# Altium schematic sheet РЕУН.468323.001_Laser_Interface.SchDoc: =Name-1str
size 840 x 594 mm; SheetNumber: 12; Вид изделия: Документация; Раздел: Документация; Код документа: Э3; Вид документа: Схема электрическая принципиальная; Класс документа: Конструкторский документ; Создавать изделие в PLM: Yes; DocumentCode: РЕУН.468323.001 Э3 2D; DocumentView: Схема электрическая принципиальная; DocumentClass: Конструкторский документ; ProductView: Документация; Format: А1
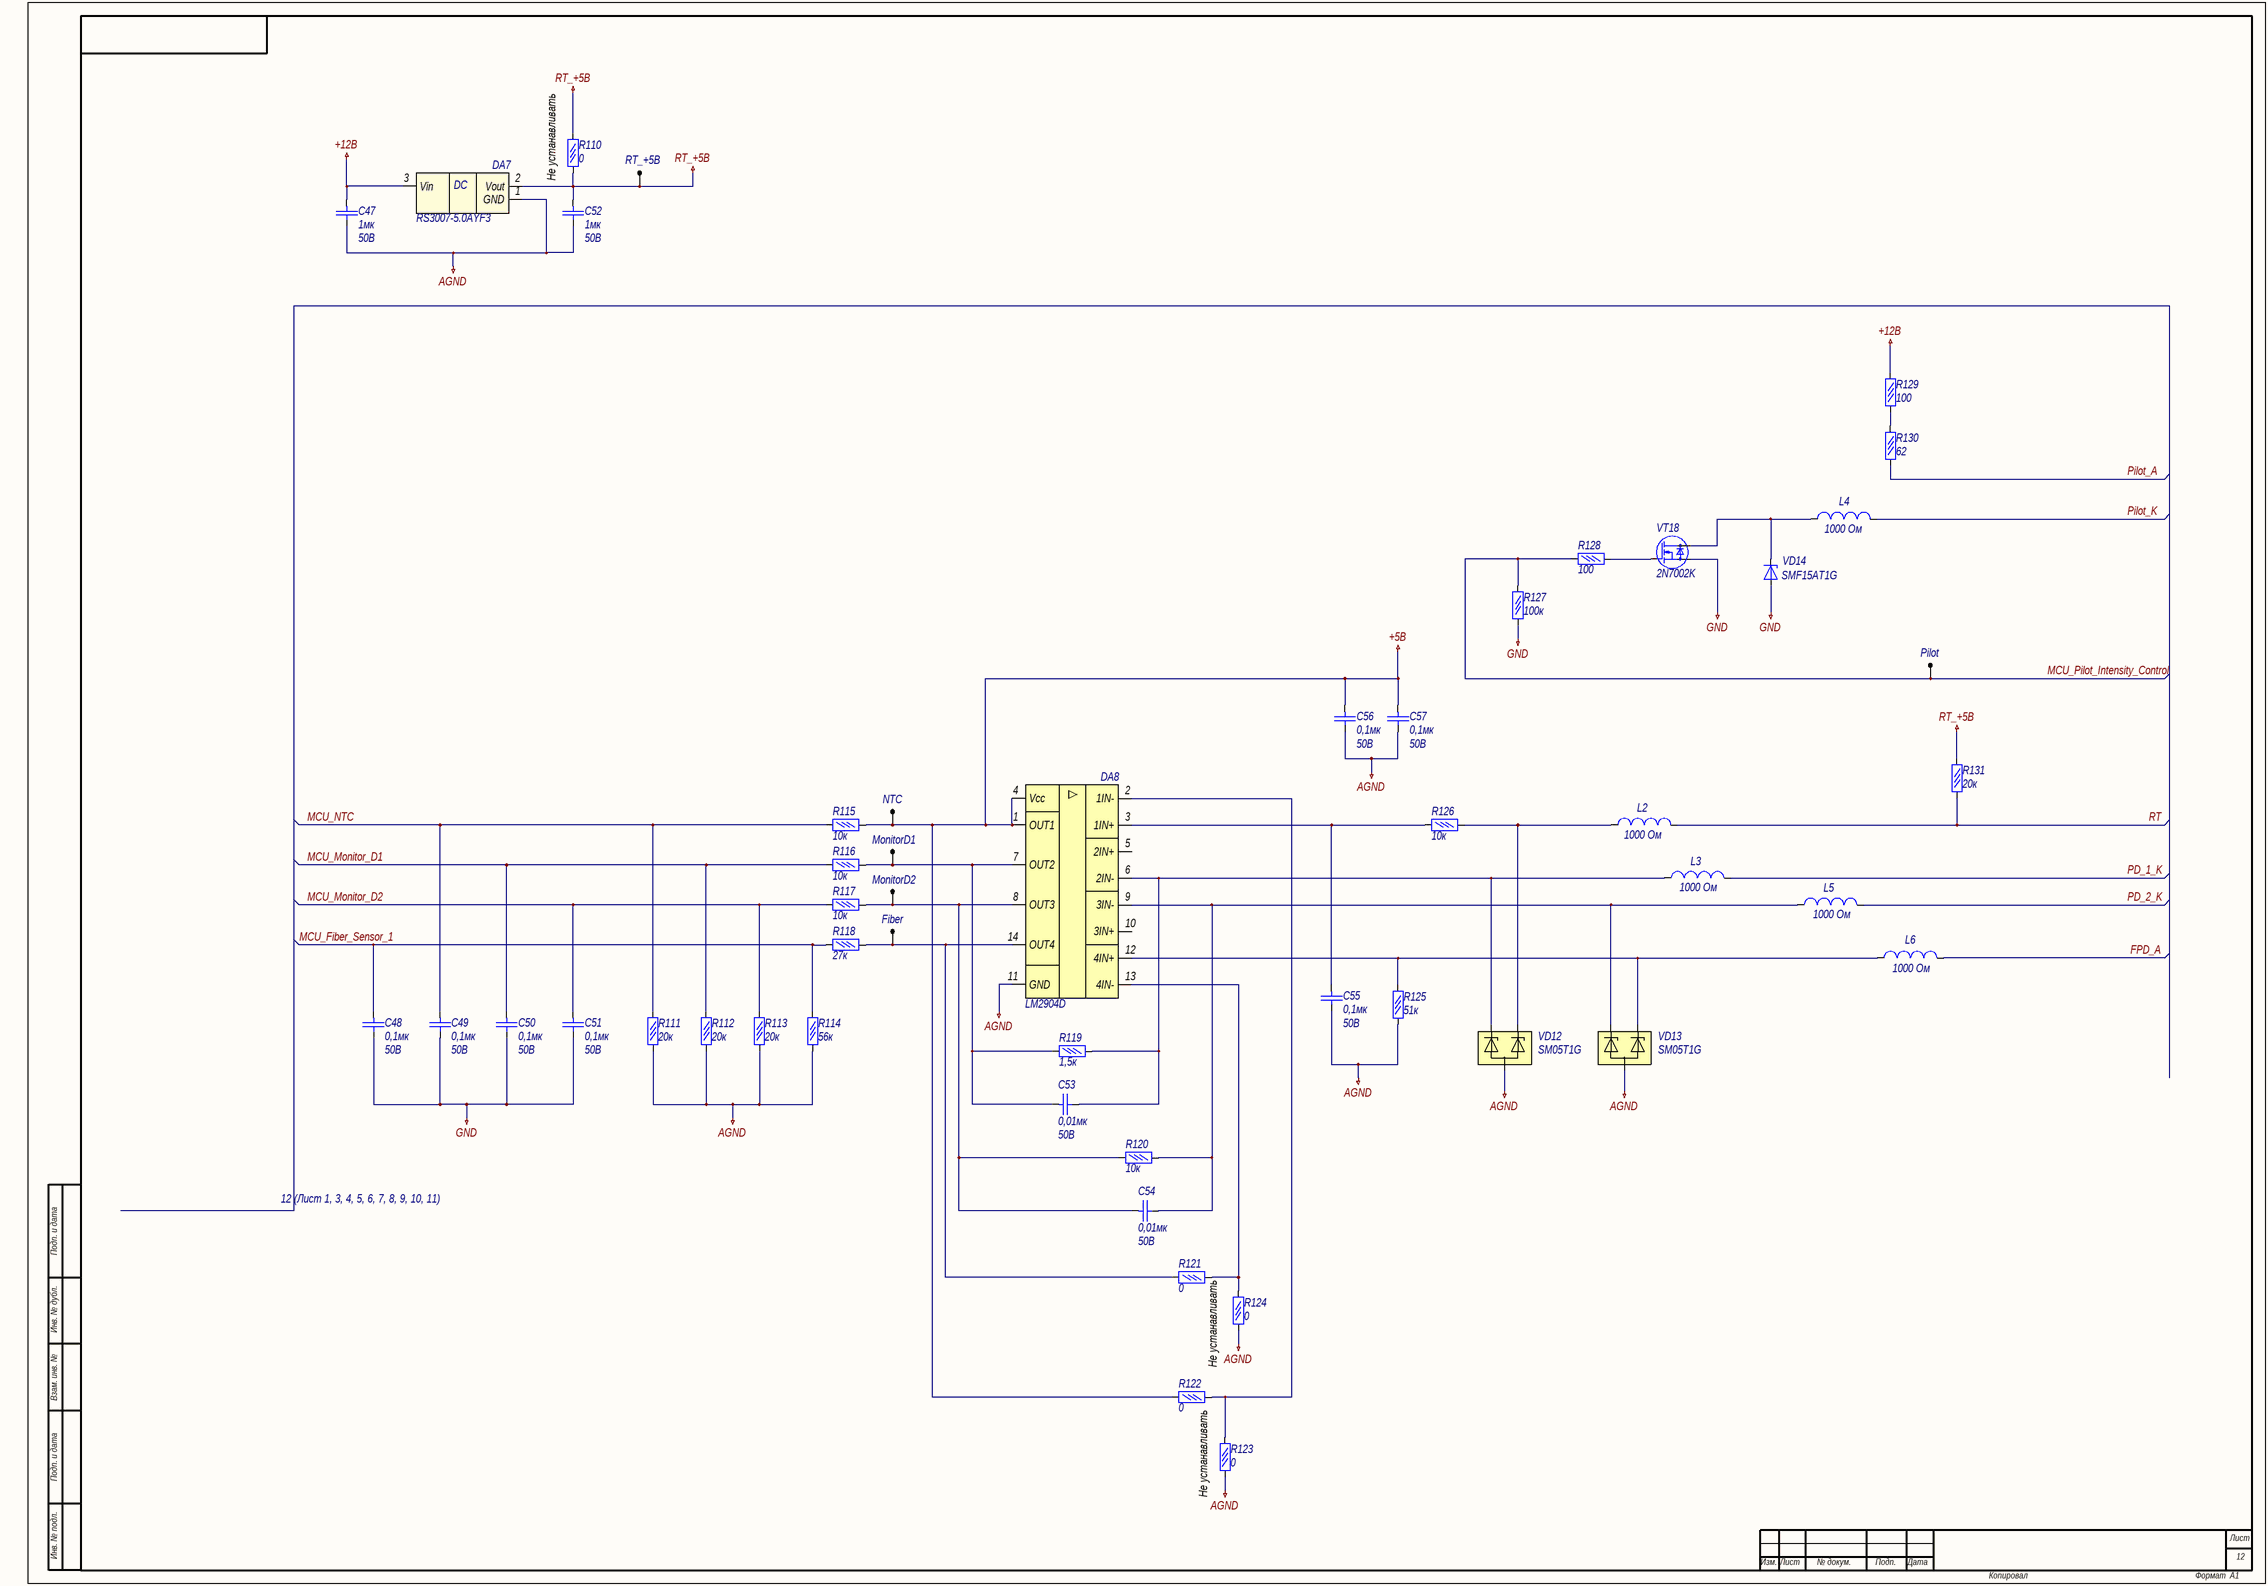
[diagram p0: РЕУН.468323.001_Laser_Interface.SchDoc]

## Parts
C47  Voltage: 50В  [C0805_AA]  (hidden comment: 1мк)
C48  Voltage: 50В  [C0805_AA]  (hidden comment: 0,1мк)
C49  Voltage: 50В  [C0805_AA]  (hidden comment: 0,1мк)
C50  Voltage: 50В  [C0805_AA]  (hidden comment: 0,1мк)
C51  Voltage: 50В  [C0805_AA]  (hidden comment: 0,1мк)
C52  Voltage: 50В  [C0805_AA]  (hidden comment: 1мк)
C53  Voltage: 50В  [C0805_AA]  (hidden comment: 0,01мк)
C54  Voltage: 50В  [C0805_AA]  (hidden comment: 0,01мк)
C55  Voltage: 50В  [C0805_AA]  (hidden comment: 0,1мк)
C56  Voltage: 50В  [C0805_AA]  (hidden comment: 0,1мк)
C57  Voltage: 50В  [C0805_AA]  (hidden comment: 0,1мк)
DA7  RS3007-5.0AYF3
DA8  LM2904D  [SO8_H]
Fiber  "1"  [0.5 x 1_round]  (value not drawn)
L2  1000 Ом  [L0603_A]
L3  1000 Ом  [L0603_A]
L4  1000 Ом  [L0603_A]
L5  1000 Ом  [L0603_A]
L6  1000 Ом  [L0603_A]
MonitorD1  "1"  [0.5 x 1_round]  (value not drawn)
MonitorD2  "1"  [0.5 x 1_round]  (value not drawn)
NTC  "1"  [0.5 x 1_round]  (value not drawn)
Pilot  "1"  [0.5 x 1_round]  (value not drawn)
R110  0  [R1206]
R111  20к  [R1206]
R112  20к  [R1206]
R113  20к  [R1206]
R114  56к  [R1206]
R115  10к  [R1206]
R116  10к  [R1206]
R117  10к  [R1206]
R118  27к  [R1206]
R119  1,5к  [R1206]
R120  10к  [R1206]
R121  0  [R1206]
R122  0  [R1206]
R123  0  [R1206]
R124  0  [R1206]
R125  51к  [R1206]
R126  10к  [R1206]
R127  100к  [R1206]
R128  100  [R1206]
R129  100  [R1206]
R130  62  [R1206]
R131  20к  [R1206]
RT_+5В  "1"  [0.5 x 1_round]  (value not drawn)
VD12  SM05T1G
VD13  SM05T1G
VD14  SMF15AT1G  [SOT23-2_A]
VT18  2N7002K  [SOT23-3]

## Nets
+5В: C56.2 C57.2 DA8.1(OUT1) DA8.4(Vcc) NTC.1 R115.2 R122.2
+12В: C47.2 DA7.3(Vin) R129.2
AGND: C47.1 C52.1 C55.1 C56.1 C57.1 DA7.1(GND) DA8.11(GND) R111.1 R112.1 R113.1 R114.1 R123.2 R124.2 R125.2 VD12.3 VD13.3
GND: C48.1 C49.1 C50.1 C51.1 R127.1 VD14.2(A) VT18.2(S)
RT_+5В: C52.2 DA7.2(Vout) R110.1 R110.2 R131.2 RT_+5В.1
FPD_A: L6.2
MCU_Fiber_Sensor_1: C48.2 R114.2 R118.1
MCU_Monitor_D1: C50.2 R112.2 R116.1
MCU_Monitor_D2: C51.2 R113.2 R117.1
MCU_NTC: C49.2 R111.2 R115.1
MCU_Pilot_Intensity_Control: Pilot.1 R127.2 R128.1
PD_1_K: L3.2
PD_2_K: L5.2
Pilot_A: R130.1
Pilot_K: L4.2
RT: L2.2 R131.1
NetC53_1: C53.1 DA8.6(2IN-) L3.1 R119.2 VD12.1
NetC53_2: C53.2 DA8.7(OUT2) MonitorD1.1 R116.2 R119.1
NetC54_1: C54.1 DA8.9(3IN-) L5.1 R120.2 VD13.1
NetC54_2: C54.2 DA8.8(OUT3) MonitorD2.1 R117.2 R120.1
NetC55_2: C55.2 DA8.3(1IN+) R126.1
NetDA8_2: DA8.2(1IN-) R122.1 R123.1
NetDA8_12: DA8.12(4IN+) L6.1 R125.1 VD13.2
NetDA8_13: DA8.13(4IN-) R121.1 R124.1
NetDA8_14: DA8.14(OUT4) Fiber.1 R118.2 R121.2
NetL2_1: L2.1 R126.2 VD12.2
NetL4_1: L4.1 VD14.1(K) VT18.3(D)
NetR128_2: R128.2 VT18.1(G)
NetR129_1: R129.1 R130.2

Not connected (* = marked no-connect by the designer): DA8 5(2IN+) 10(3IN+)

## Notes on the sheet
- (near R110) Не устанавливать
- 12 (Лист 1, 3, 4, 5, 6, 7, 8, 9, 10, 11)
- (near R121) Не устанавливать
- (near R122) Не устанавливать
- Подп. и дата
- Инв. № дубл.
- Взам. инв. №
- Инв. № подл.
- Лист
- Изм.
- № докум.
- Подп.
- Дата
- Копировал
- Формат
- (in symbol L78_1) DC

## Library data of the parts
C47-C57 = Конденсатор кер.
  C47 C52: Value: 1мк
  C48-C51 C55-C57: Value: 0,1мк
  C53 C54: Value: 0,01мк
DA7 = L78_1: Линейный стабилизатор напряжения
DA8 = LM2902D: ОУ; Name: LM2904D
Fiber MonitorD1 MonitorD2 NTC Pilot RT_+5В = TestPoint: Test point; Comment_1: "1"
L2-L6 = Inductor: Катушка индуктивности; Value: 1000 Ом
R110-R131 = Резистор  0,05Вт: Резистор 0,05Вт; Power rating: 0,05Вт
  R110 R121-R124: Value: 0
  R111-R113 R131: Value: 20к
  R114: Value: 56к
  R115-R117 R120 R126: Value: 10к
  R118: Value: 27к
  R119: Value: 1,5к
  R125: Value: 51к
  R127: Value: 100к
  R128 R129: Value: 100
  R130: Value: 62
VD12 VD13 = ZenerArray2: Сборка TVS-диодов; Parameter 1: *
VD14 = DiodeZener: Стабилитрон; Name: SMF15AT1G
VT18 = mosfet-n: Name: 2N7002K